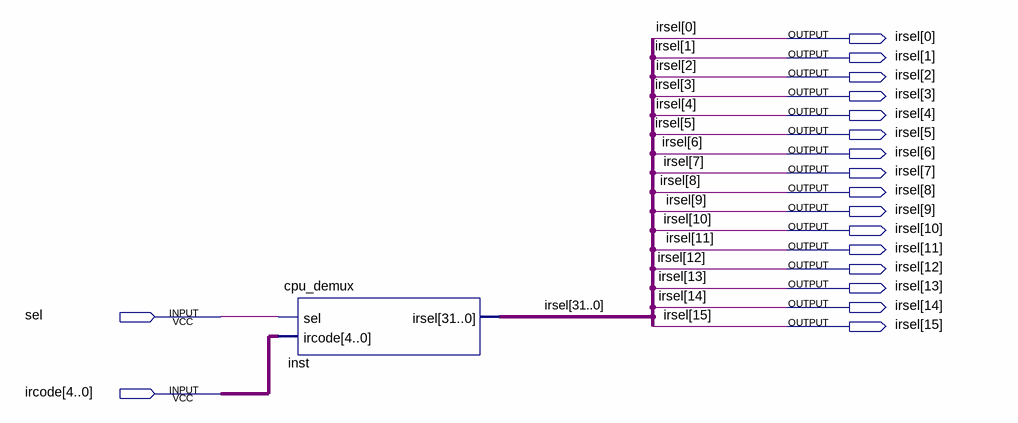
[diagram p0: schematic sheet]
// Quartus schematic xcmcpu.bdf as structural Verilog: 1 symbols, 18 pins
module xcmcpu (
  input  sel,
  input  [4:0] ircode,
  output [31:0] irsel
);

  cpu_demux inst (.sel(sel), .ircode(ircode), .irsel(irsel));
endmodule
